# Altium schematic sheet Э3.SchDoc
size A4; SheetNumber: 1; SheetTotal: 1
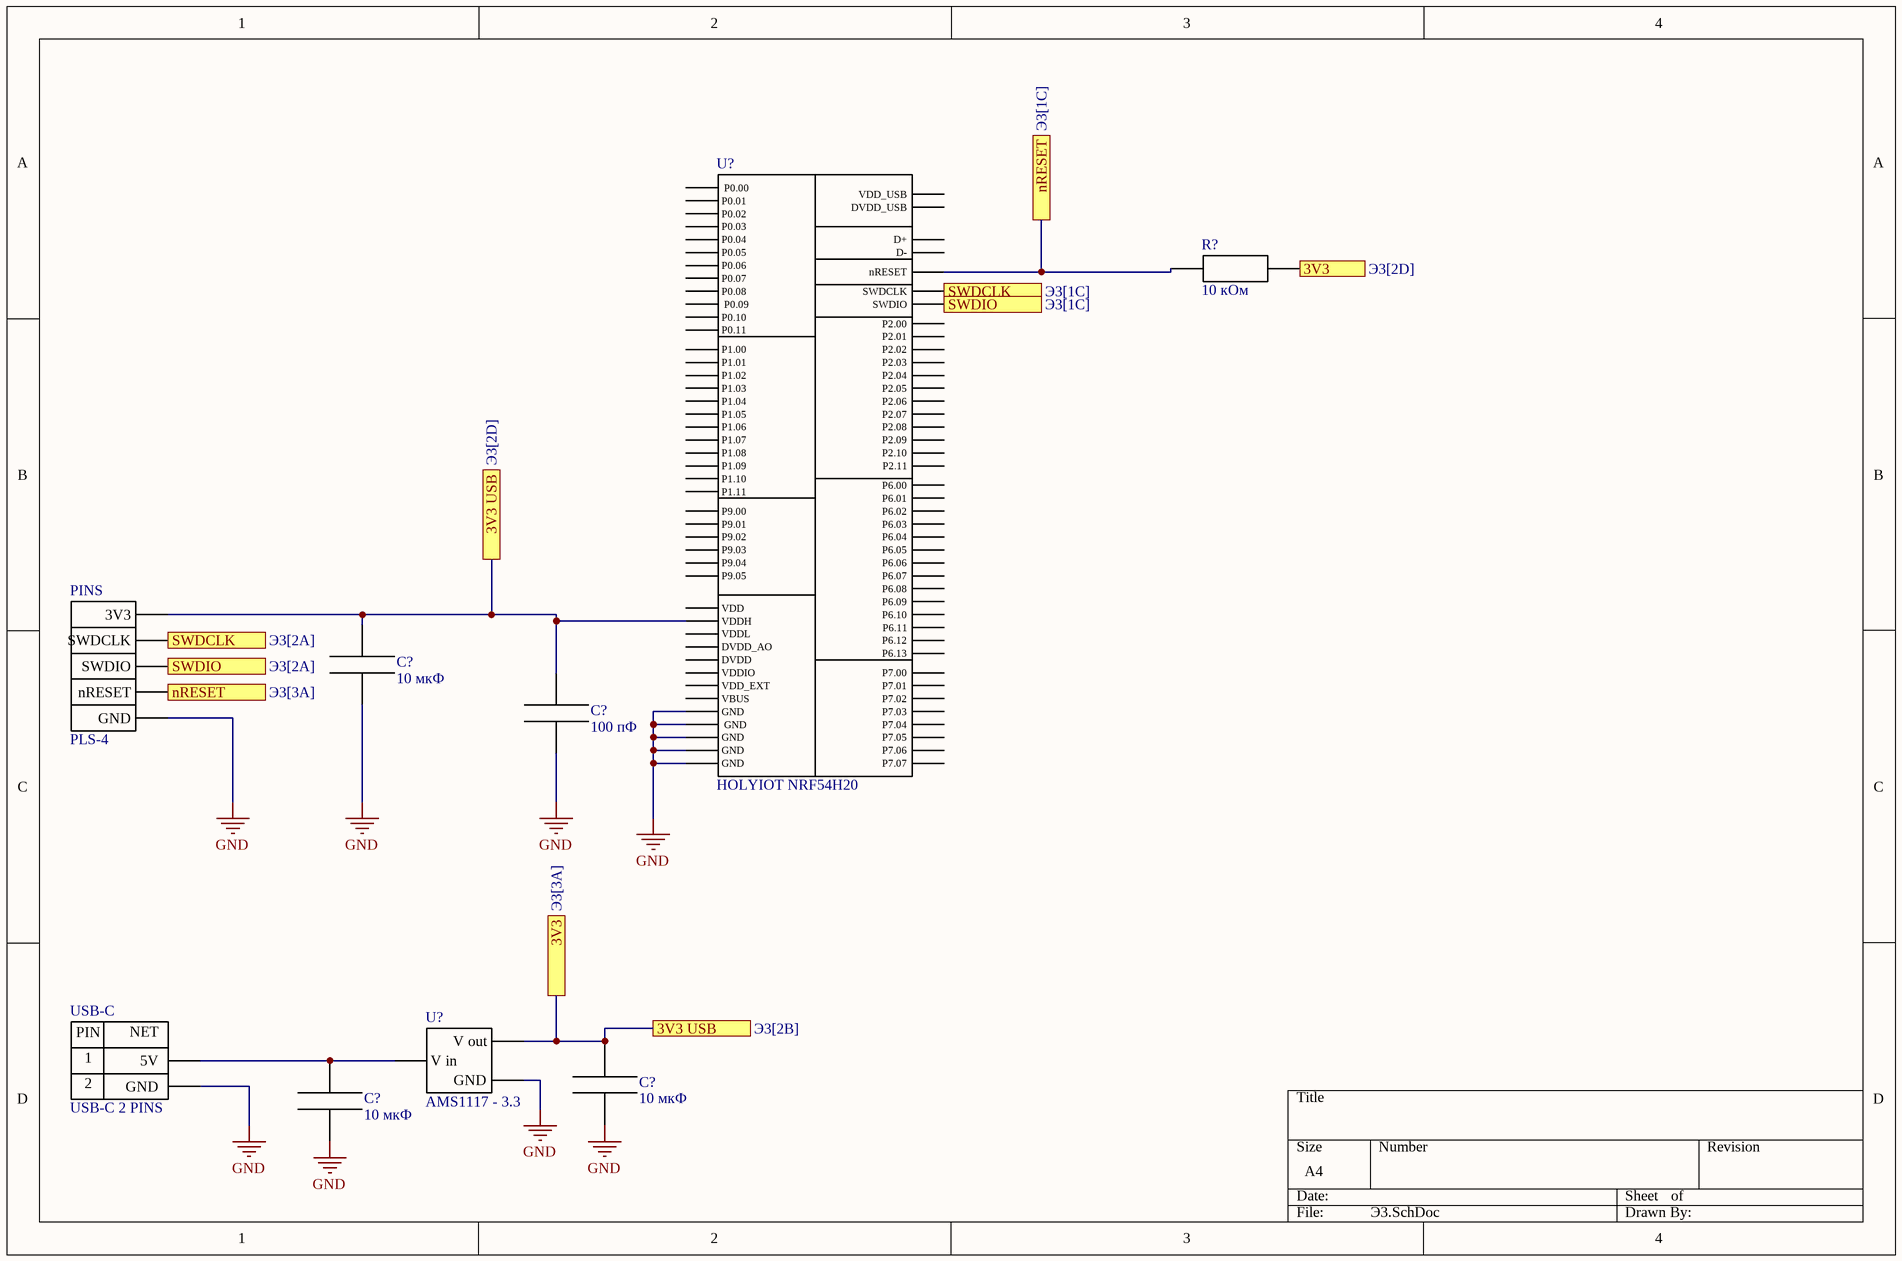
[diagram p0: Э3.SchDoc]

## Parts
(Parts that share a designator on the sheet are numbered #1, #2 ... from top to bottom, then left to right.)
C?  100 пФ  [Murata GRM2165C1H101J]
PINS  PLS-4  [PLS-4 (DS-1021-1x4)]
R?  10 кОм  [Yageo RC0805JR-0710KL]
U?#1  HOLYIOT NRF54H20  [HOLYIOT NRF54H20]
U?#2  AMS1117 - 3.3  [AMS 1117 - 3.3]
USB-C  USB-C 2 PINS  [RUICHI USB3.1 TYPE-C 02PF-023]
С?#1  10 мкФ  [Murata GRM21BR60J106K]
С?#2  10 мкФ  [Murata GRM21BR60J106K]
С?#3  10 мкФ  [Murata GRM21BR60J106K]

## Ports
3V3 (see Э3[2D]), 3V3 (see Э3[3A]), 3V3 USB (see Э3[2B]), 3V3 USB (see Э3[2D]), nRESET (see Э3[1C]), nRESET (see Э3[3A]), SWDCLK (see Э3[1C]), SWDCLK (see Э3[2A]), SWDIO (see Э3[1C]), SWDIO (see Э3[2A])

## Nets
GND: C?.1 PINS.5(GND) U?#1.1(GND) U?#1.4(GND) U?#1.28(GND) U?#1.29(GND) U?#1.58(GND) U?#2.1(GND) USB-C.2(GND) С?#1.1 С?#2.1 С?#3.1
3V3: C?.2 PINS.1(3V3) R?.2 U?#1.2(VDDH) U?#2.2(V_out) С?#1.2 С?#2.2 ; port 3V3, port 3V3 USB
nRESET: PINS.4(nRESET) R?.1 U?#1.72(nRESET) ; port nRESET
SWDCLK: PINS.2(SWDCLK) U?#1.74(SWDCLK) ; port SWDCLK
SWDIO: PINS.3(SWDIO) U?#1.73(SWDIO) ; port SWDIO
NetU?#2_3: U?#2.3(V_in) USB-C.1(5V) С?#3.2

Not connected (* = marked no-connect by the designer): U?#1 3(VDD) 5(DVDD) 6(DVDD_AO) 7(P6.13) 8(P6.12) 9(P6.11) 10(P6.10) 11(P6.09) 12(P6.08) 13(P6.07) 14(P6.06) 15(P6.00) 16(P6.01) 17(P6.02) 18(P6.03) 19(P6.04) 20(P6.05) 21(P2.00) 22(P2.01) 23(P2.02) 24(P2.03) 25(P2.04) 26(P2.11) 27(P2.10) 30(P2.09) 31(P2.08) 32(P2.07) 33(P2.06) 34(P2.05) 35(P7.07) 36(P7.06) 37(P7.05) 38(P7.04) 39(P7.03) 40(P7.02) 41(P7.01) 42(P7.00) 43(_P0.09) 44(P0.08) 45(P0.05) 46(P0.06) 47(P0.07) 48(P9.00) 49(P9.01) 50(_P0.00) 51(P0.04) 52(P1.04) 53(P1.03) 54(P1.02) 55(VDDL) 56(P1.01) 57(P1.00) 59(P1.06) 60(P1.07) 61(P1.09) 62(P9.05) 63(P9.04) 64(P9.03) 65(P9.02) 66(P0.03) 67(P0.02) 68(P0.01) 69(P0.10) 70(P0.11) 71(VDDIO) 75(VDD_EXT) 76(DVDD_USB) 77(VBUS) 78(D-) 79(D+) 80(VDD_USB) 81(P1.10) 82(P1.11) 83(P1.08) 84(P1.05)

## Notes on the sheet
- (in symbol RUICHI USB3.1 TYPE-C 02PF-023) PIN; NET

## Library data of the parts
C? = Murata GRM2165C1H101J
PINS = PLS-4 (DS-1021-1x4)
R? = Yageo RC0805JR-0710KL
USB-C = RUICHI USB3.1 TYPE-C 02PF-023
С?#1-С?#3 = Murata GRM21BR60J106K